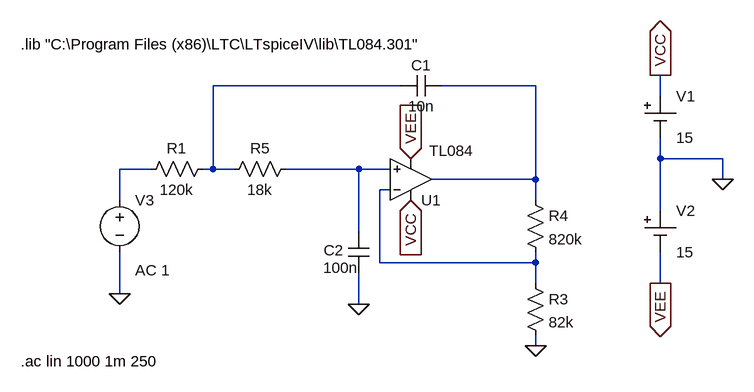
[diagram p0: schematic LPF.asc]
LPF.asc, the LTspice schematic file:
Version 4
SHEET 1 880 680
WIRE 320 32 32 32
WIRE 528 32 384 32
WIRE 720 48 720 16
WIRE 720 144 720 112
WIRE 816 144 720 144
WIRE -64 160 -112 160
WIRE 32 160 32 32
WIRE 32 160 16 160
WIRE 64 160 32 160
WIRE 256 160 144 160
WIRE 304 160 256 160
WIRE 528 176 528 32
WIRE 528 176 368 176
WIRE 816 176 816 144
WIRE 304 192 288 192
WIRE -112 208 -112 160
WIRE 528 208 528 176
WIRE 720 224 720 144
WIRE 256 256 256 160
WIRE 288 304 288 192
WIRE 528 304 528 288
WIRE 528 304 288 304
WIRE 528 336 528 304
WIRE 720 336 720 288
WIRE -112 352 -112 288
WIRE 256 368 256 320
WIRE 528 432 528 416
FLAG 256 368 0
FLAG 528 432 0
FLAG 816 176 0
FLAG 720 336 VEE
IOPIN 720 336 Out
FLAG 336 144 VEE
IOPIN 336 144 In
FLAG 720 16 VCC
IOPIN 720 16 Out
FLAG 336 208 VCC
IOPIN 336 208 In
FLAG -112 352 0
SYMBOL Opamps\\opamp2 336 240 M180
WINDOW 3 28 108 Left 2
SYMATTR Value TL084
SYMATTR InstName U1
SYMBOL res 32 144 R90
WINDOW 0 0 56 VBottom 2
WINDOW 3 32 56 VTop 2
SYMATTR InstName R1
SYMATTR Value 120k
SYMBOL cap 384 16 R90
WINDOW 0 0 32 VBottom 2
WINDOW 3 32 32 VTop 2
SYMATTR InstName C1
SYMATTR Value 10n
SYMBOL cap 240 256 R0
WINDOW 0 -38 29 Left 2
WINDOW 3 -39 56 Left 2
SYMATTR InstName C2
SYMATTR Value 100n
SYMBOL res 512 192 R0
SYMATTR InstName R4
SYMATTR Value 820k
SYMBOL res 512 320 R0
SYMATTR InstName R3
SYMATTR Value 82k
SYMBOL Misc\\cell 720 48 R0
WINDOW 123 0 0 Left 2
WINDOW 39 0 0 Left 2
SYMATTR InstName V1
SYMATTR Value 15
SYMBOL Misc\\cell 720 224 R0
WINDOW 123 0 0 Left 2
WINDOW 39 0 0 Left 2
SYMATTR InstName V2
SYMATTR Value 15
SYMBOL voltage -112 192 R0
WINDOW 123 24 124 Left 2
WINDOW 39 0 0 Left 2
SYMATTR Value2 AC 1
SYMATTR InstName V3
SYMATTR Value ""
SYMBOL res 160 144 R90
WINDOW 0 0 56 VBottom 2
WINDOW 3 32 56 VTop 2
SYMATTR InstName R5
SYMATTR Value 18k
TEXT -264 -32 Left 2 !.lib "C:\\Program Files (x86)\\LTC\\LTspiceIV\\lib\\TL084.301"
TEXT -264 456 Left 2 !.ac lin 1000 1m 250

The netlist it stands for:
* LPF.asc
XU1 N004 N005 VCC VEE N002 TL084  ; pins In+ In- V+ V- OUT
R1 N001 N003 120k
C1 N002 N001 10n
C2 N004 0 100n
R4 N002 N005 820k
R3 N005 0 82k
V1 VCC 0 15
V2 0 VEE 15
V3 N003 0 AC 1
R5 N004 N001 18k
.lib "C:\Program Files (x86)\LTC\LTspiceIV\lib\TL084.301"
.ac lin 1000 1m 250
.backanno
.end